# Altium schematic sheet ETH_PHY_SW_L2L3.SchDoc: RFSoC AMC
size 420 x 297 mm; CompanyName: WUT; DrawnBy: T. Przywozki; Organization: WUT ISE; Address1: Warsaw University of Technology; Address2: Nowowiejska 15/19 00-665 Warsaw; Address3: Tomasz.Przywozki@pw.edu.pl; DocumentNumber: 25; Revision: 1; SheetNumber: 25; SheetTotal: 45; Project: RFSoC AMC; ModifiedBy: T. Przywozki; CreateDate: -; CheckedDate: -; DivGrp: ISE; Designer: T. Przywozki; ModifiedDate: -; ProjectName: ADC/DAC MEZZANINE
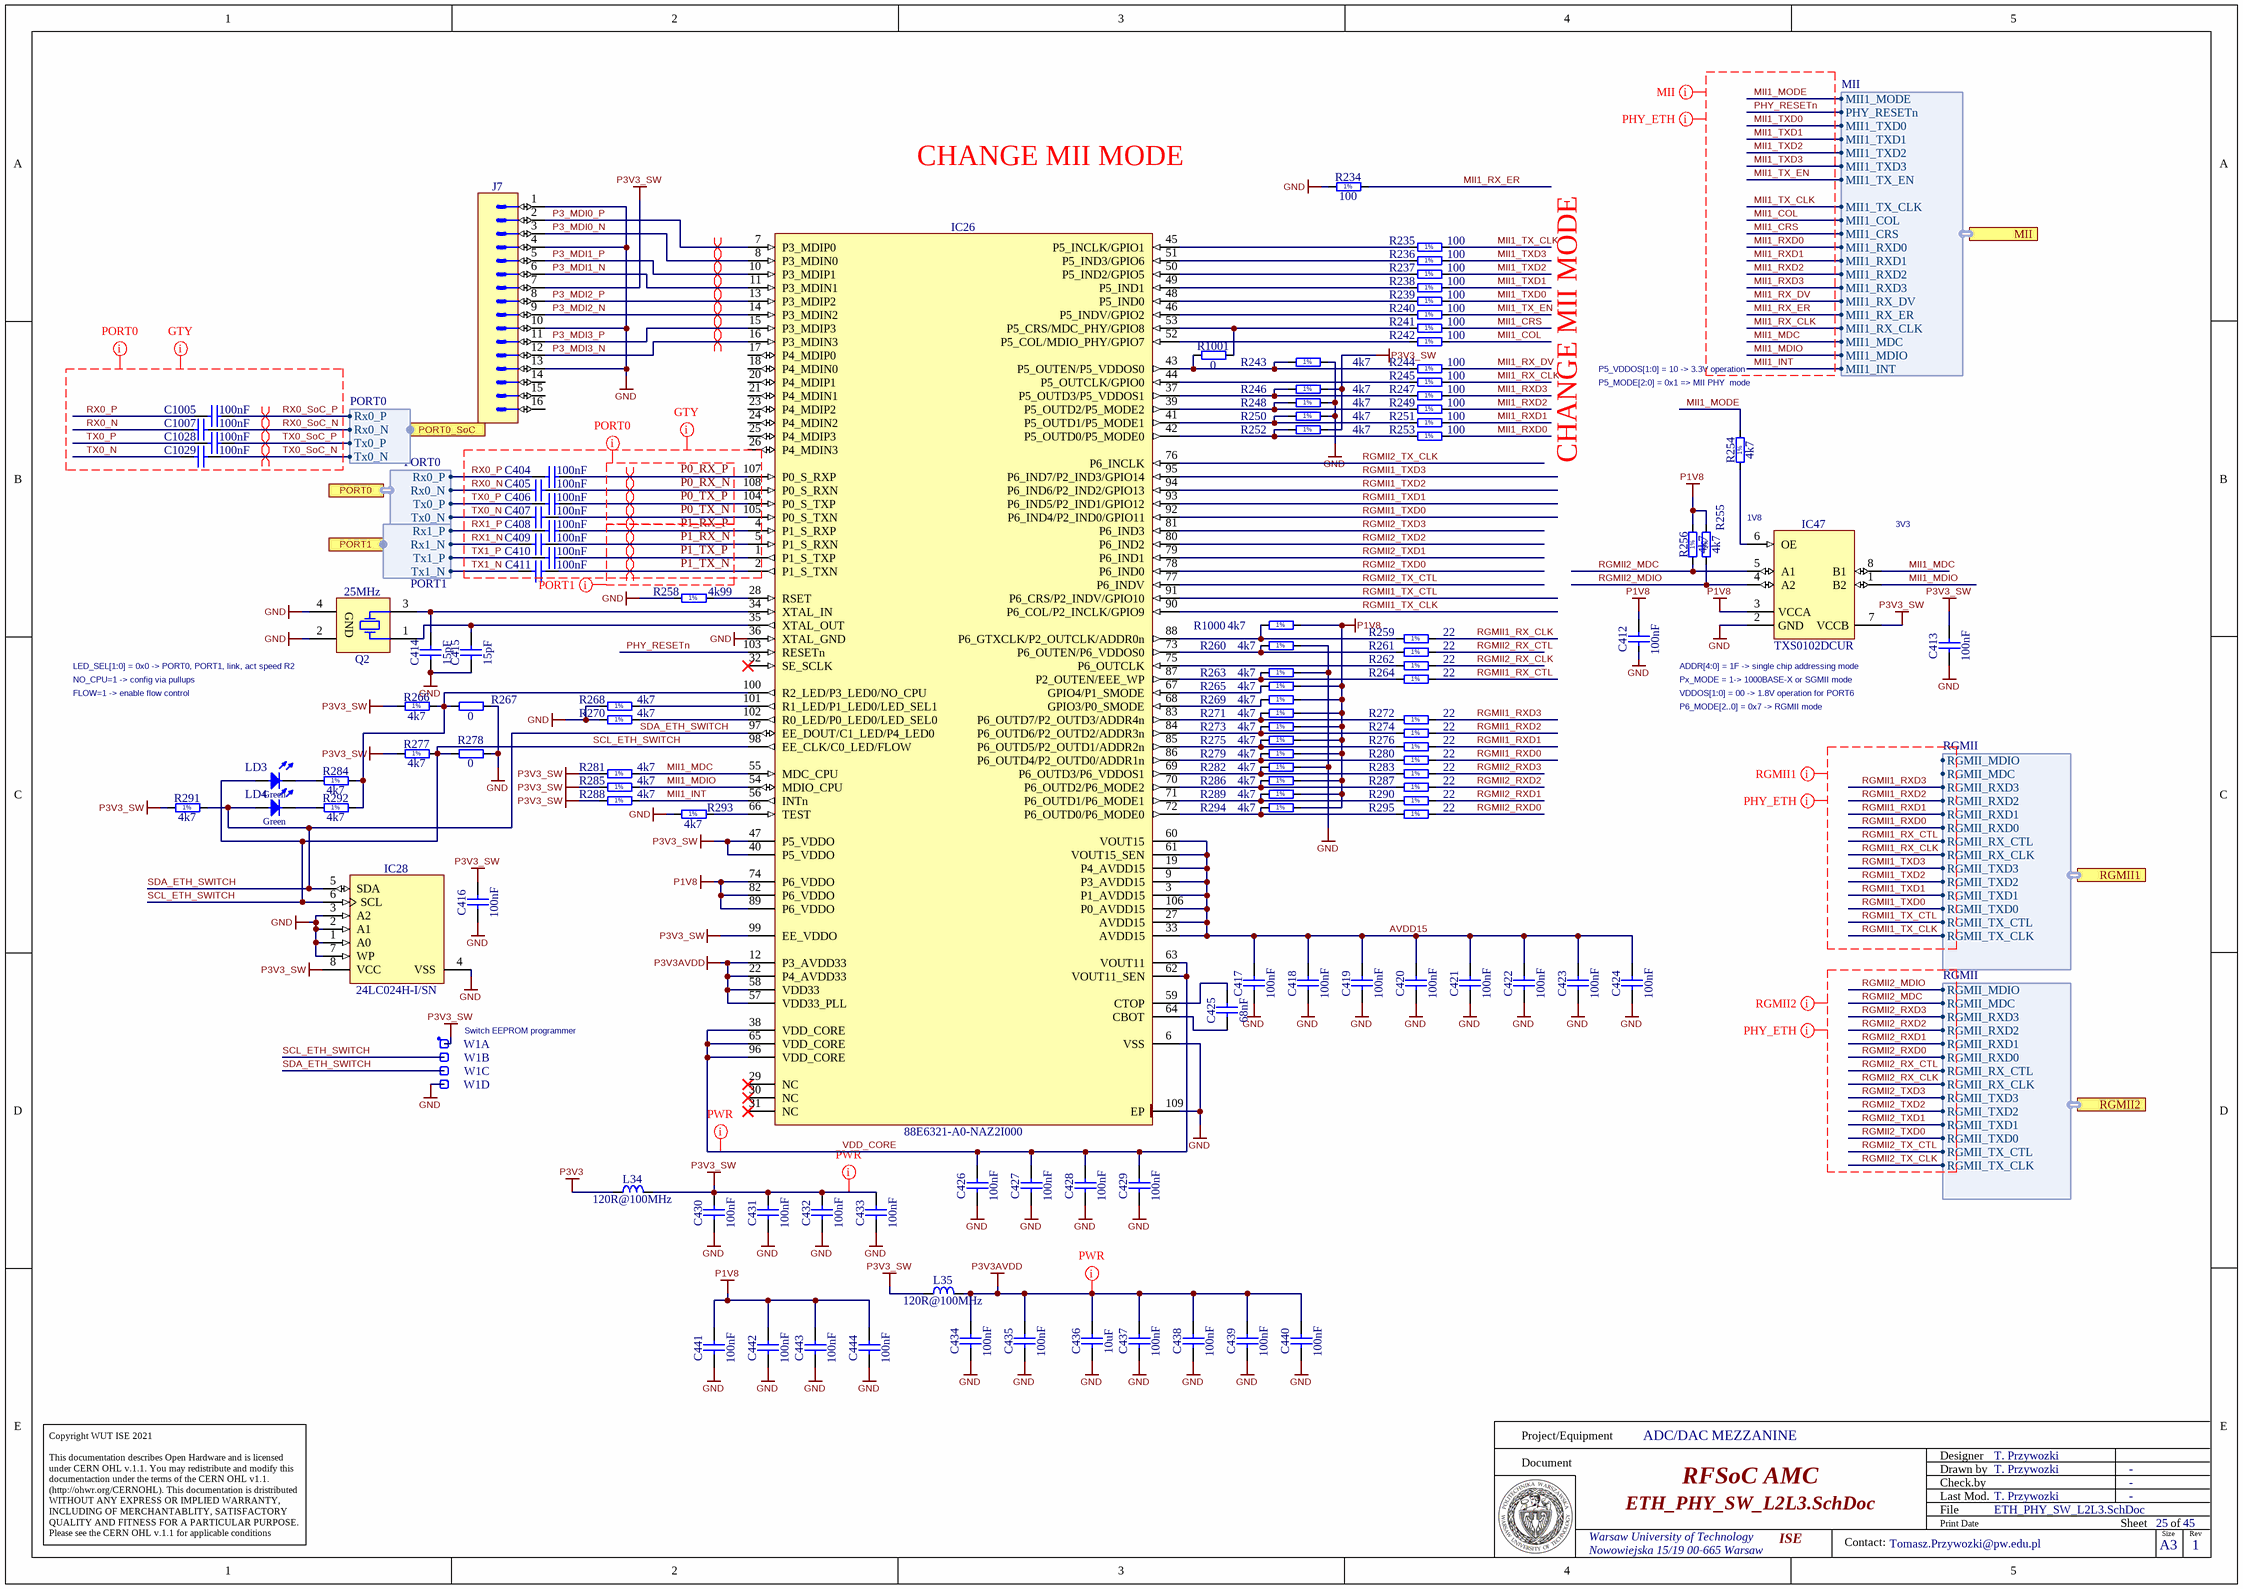
[diagram p0: ETH_PHY_SW_L2L3.SchDoc]

## Parts
C404  100nF  [CAPC0603X33N]
C405  100nF  [CAPC0603X33N]
C406  100nF  [CAPC0603X33N]
C407  100nF  [CAPC0603X33N]
C408  100nF  [CAPC0603X33N]
C409  100nF  [CAPC0603X33N]
C410  100nF  [CAPC0603X33N]
C411  100nF  [CAPC0603X33N]
C412  100nF  [CAPC0603X33N]
C413  100nF  [CAPC0603X33N]
C414  15pF  [CAPC1005X55N]
C415  15pF  [CAPC1005X55N]
C416  100nF  [CAPC0603X33N]
C417  100nF  [CAPC0603X33N]
C418  100nF  [CAPC0603X33N]
C419  100nF  [CAPC0603X33N]
C420  100nF  [CAPC0603X33N]
C421  100nF  [CAPC0603X33N]
C422  100nF  [CAPC0603X33N]
C423  100nF  [CAPC0603X33N]
C424  100nF  [CAPC0603X33N]
C425  68nF  [CAPC1005X55N]
C426  100nF  [CAPC0603X33N]
C427  100nF  [CAPC0603X33N]
C428  100nF  [CAPC0603X33N]
C429  100nF  [CAPC0603X33N]
C430  100nF  [CAPC0603X33N]
C431  100nF  [CAPC0603X33N]
C432  100nF  [CAPC0603X33N]
C433  100nF  [CAPC0603X33N]
C434  100nF  [CAPC0603X33N]
C435  100nF  [CAPC0603X33N]
C436  10uF  [CAPC1608X87N]
C437  100nF  [CAPC0603X33N]
C438  100nF  [CAPC0603X33N]
C439  100nF  [CAPC0603X33N]
C440  100nF  [CAPC0603X33N]
C441  100nF  [CAPC0603X33N]
C442  100nF  [CAPC0603X33N]
C443  100nF  [CAPC0603X33N]
C444  100nF  [CAPC0603X33N]
C1005  100nF  [CAPC0603X33N]
C1007  100nF  [CAPC0603X33N]
C1028  100nF  [CAPC0603X33N]
C1029  100nF  [CAPC0603X33N]
IC26  88E6321-A0-NAZ2I000  [QFN40P1200X1200X90-109N-S475]
IC28  24LC024H-I/SN  [SOIC127P600X175-8N]
IC47  TXS0102DCUR  [SOP50P310X90-8N]
J7  Milli-Grid™  [MOLEX_87759-1650]  (value not drawn)
L34  120R@100MHz  [INDC1608X65N]
L35  120R@100MHz  [INDC1608X65N]
LD3  Green  [LED_KINGBRIGHT_KPH-1608CGCK]
LD4  Green  [LED_KINGBRIGHT_KPH-1608CGCK]
Q2  25MHz  [XTAL_TXC_8Y]
R234  100  [RESC0603X28N]
R235  100  [RESC0603X28N]
R236  100  [RESC0603X28N]
R237  100  [RESC0603X28N]
R238  100  [RESC0603X28N]
R239  100  [RESC0603X28N]
R240  100  [RESC0603X28N]
R241  100  [RESC0603X28N]
R242  100  [RESC0603X28N]
R243  4k7  [RESC1005X40N]
R244  100  [RESC0603X28N]
R245  100  [RESC0603X28N]
R246  4k7  [RESC1005X40N]
R247  100  [RESC0603X28N]
R248  4k7  [RESC1005X40N]
R249  100  [RESC0603X28N]
R250  4k7  [RESC1005X40N]
R251  100  [RESC0603X28N]
R252  4k7  [RESC1005X40N]
R253  100  [RESC0603X28N]
R254  4k7  [RESC1005X40N]
R255  4k7  [RESC1005X40N]
R256  4k7  [RESC1005X40N]
R258  4k99  [RESC1608X55N]
R259  22  [RESC1005X40N]
R260  4k7  [RESC1005X40N]
R261  22  [RESC1005X40N]
R262  22  [RESC1005X40N]
R263  4k7  [RESC1005X40N]
R264  22  [RESC1005X40N]
R265  4k7  [RESC1005X40N]
R266  4k7  [RESC1005X40N]
R267  0  [RESC1005X40N]
R268  4k7  [RESC1005X40N]
R269  4k7  [RESC1005X40N]
R270  4k7  [RESC1005X40N]
R271  4k7  [RESC1005X40N]
R272  22  [RESC1005X40N]
R273  4k7  [RESC1005X40N]
R274  22  [RESC1005X40N]
R275  4k7  [RESC1005X40N]
R276  22  [RESC1005X40N]
R277  4k7  [RESC1005X40N]
R278  0  [RESC1005X40N]
R279  4k7  [RESC1005X40N]
R280  22  [RESC1005X40N]
R281  4k7  [RESC1005X40N]
R282  4k7  [RESC1005X40N]
R283  22  [RESC1005X40N]
R284  4k7  [RESC1005X40N]
R285  4k7  [RESC1005X40N]
R286  4k7  [RESC1005X40N]
R287  22  [RESC1005X40N]
R288  4k7  [RESC1005X40N]
R289  4k7  [RESC1005X40N]
R290  22  [RESC1005X40N]
R291  4k7  [RESC1005X40N]
R292  4k7  [RESC1005X40N]
R293  4k7  [RESC1005X40N]
R294  4k7  [RESC1005X40N]
R295  22  [RESC1005X40N]
R1000  4k7  [RESC1005X40N]
R1001  0  [RESC1005X40N]
W1  Header 4  [SAMTEC_MTLW-104-07-L-S-250]  (value not drawn)  (parts A,B,C,D of 4)

## Ports
MII (harness MII), PORT0 (harness PORT0), PORT0_SoC (harness PORT0), PORT1 (harness PORT1), RGMII1 (harness RGMII), RGMII2 (harness RGMII)

## Harnesses
RGMII: RGMII_TX_CLK, RGMII_TX_CTL, RGMII_TXD0, RGMII_TXD1, RGMII_TXD2, RGMII_TXD3, RGMII_RX_CTL, RGMII_RX_CLK, RGMII_RXD0, RGMII_RXD1, RGMII_RXD2, RGMII_RXD3, RGMII_MDC, RGMII_MDIO
MII: MII1_MODE, MII1_TXD0, MII1_TXD2, MII1_TXD3, MII1_TX_EN, MII1_TX_CLK, MII1_COL, MII1_CRS, MII1_RXD0, MII1_RXD1, MII1_RXD2, MII1_RXD3, MII1_RX_DV, MII1_RX_ER, MII1_RX_CLK, MII1_MDC, MII1_MDIO, MII1_INT, PHY_RESETn, MII1_TXD1
PORT1: Rx1_P, Rx1_N, Tx1_N, Tx1_P
PORT0: Rx0_P, Rx0_N, Tx0_N, Tx0_P

## Nets
GND: C412.1 C413.1 C414.1 C415.1 C416.1 C417.1 C418.1 C419.1 C420.1 C421.1 C422.1 C423.1 C424.1 C426.1 C427.1 C428.1 C429.1 C430.1 C431.1 C432.1 C433.1 C434.1 C435.1 C436.1 C437.1 C438.1 C439.1 C440.1 C441.1 C442.1 C443.1 C444.1 IC26.6(VSS) IC26.36(XTAL_GND) IC26.109(EP) IC28.1(A0) IC28.2(A1) IC28.3(A2) IC28.4(VSS) IC28.7(WP) IC47.2(GND) J7.1 J7.4 J7.10 J7.13 Q2.2(GND) Q2.4(GND) R234.1 R243.2 R248.2 R250.2 R258.1 R260.2 R263.2 R267.2 R268.1 R270.1 R278.2 R282.2 R293.1 W1.4
P1V8: C412.2 C441.2 C442.2 C443.2 C444.2 IC26.74(P6_VDDO) IC26.82(P6_VDDO) IC26.89(P6_VDDO) IC47.3(Vcca) R255.2 R256.2 R265.2 R269.2 R271.2 R273.2 R275.2 R279.2 R286.2 R289.2 R294.2 R1000.2
P3V3: L34.1
P3V3_SW: C413.2 C416.2 C430.2 C431.2 C432.2 C433.2 IC26.40(P5_VDDO) IC26.47(P5_VDDO) IC26.99(EE_VDDO) IC28.8(VCC) IC47.7(Vccb) J7.7 L34.2 L35.1 R246.2 R252.2 R266.1 R277.1 R281.1 R285.1 R288.1 R291.1 W1.1
P3V3AVDD: C434.2 C435.2 C436.2 C437.2 C438.2 C439.2 C440.2 IC26.12(P3_AVDD33) IC26.22(P4_AVDD33) IC26.57(VDD33_PLL) IC26.58(VDD33) L35.2
AVDD15: C417.2 C418.2 C419.2 C420.2 C421.2 C422.2 C423.2 C424.2 IC26.3(P1_AVDD15) IC26.9(P3_AVDD15) IC26.19(P4_AVDD15) IC26.27(AVDD15) IC26.33(AVDD15) IC26.60(VOUT15) IC26.61(VOUT15_SEN) IC26.106(P0_AVDD15)
MII1_COL: R242.2 ; port MII.MII1_COL
MII1_CRS: R241.2 ; port MII.MII1_CRS
MII1_INT: IC26.56(INTn) R288.2 ; port MII.MII1_INT
MII1_MDC: IC26.55(MDC_CPU) IC47.8(B1) R281.2 ; port MII.MII1_MDC
MII1_MDIO: IC26.54(MDIO_CPU) IC47.1(B2) R285.2 ; port MII.MII1_MDIO
MII1_MODE: R254.2 ; port MII.MII1_MODE
MII1_RX_CLK: R245.2 ; port MII.MII1_RX_CLK
MII1_RX_DV: R244.2 ; port MII.MII1_RX_DV
MII1_RX_ER: R234.2 ; port MII.MII1_RX_ER
MII1_RXD0: R253.2 ; port MII.MII1_RXD0
MII1_RXD1: R251.2 ; port MII.MII1_RXD1
MII1_RXD2: R249.2 ; port MII.MII1_RXD2
MII1_RXD3: R247.2 ; port MII.MII1_RXD3
MII1_TX_CLK: R235.2 ; port MII.MII1_TX_CLK
MII1_TX_EN: R240.2 ; port MII.MII1_TX_EN
MII1_TXD0: R239.2 ; port MII.MII1_TXD0
MII1_TXD1: R238.2 ; port MII.MII1_TXD1
MII1_TXD2: R237.2 ; port MII.MII1_TXD2
MII1_TXD3: R236.2 ; port MII.MII1_TXD3
P0_RX_N: C405.2 IC26.108(P0_S_RXN)
P0_RX_P: C404.2 IC26.107(P0_S_RXP)
P0_TX_N: C407.2 IC26.105(P0_S_TXN)
P0_TX_P: C406.2 IC26.104(P0_S_TXP)
P1_RX_N: C409.2 IC26.5(P1_S_RXN)
P1_RX_P: C408.2 IC26.4(P1_S_RXP)
P1_TX_N: C411.2 IC26.2(P1_S_TXN)
P1_TX_P: C410.2 IC26.1(P1_S_TXP)
P3_MDI0_N: IC26.8(P3_MDIN0) J7.3
P3_MDI0_P: IC26.7(P3_MDIP0) J7.2
P3_MDI1_N: IC26.11(P3_MDIN1) J7.6
P3_MDI1_P: IC26.10(P3_MDIP1) J7.5
P3_MDI2_N: IC26.14(P3_MDIN2) J7.9
P3_MDI2_P: IC26.13(P3_MDIP2) J7.8
P3_MDI3_N: IC26.16(P3_MDIN3) J7.12
P3_MDI3_P: IC26.15(P3_MDIP3) J7.11
PHY_RESETn: IC26.103(RESETn) ; port MII.PHY_RESETn
RGMII1_RX_CLK: R259.2 ; port RGMII1.RGMII_RX_CLK
RGMII1_RX_CTL: R264.2 ; port RGMII1.RGMII_RX_CTL
RGMII1_RXD0: R280.2 ; port RGMII1.RGMII_RXD0
RGMII1_RXD1: R276.2 ; port RGMII1.RGMII_RXD1
RGMII1_RXD2: R274.2 ; port RGMII1.RGMII_RXD2
RGMII1_RXD3: R272.2 ; port RGMII1.RGMII_RXD3
RGMII1_TX_CLK: IC26.90(P6_COL/P2_INCLK/GPIO9) ; port RGMII1.RGMII_TX_CLK
RGMII1_TX_CTL: IC26.91(P6_CRS/P2_INDV/GPIO10) ; port RGMII1.RGMII_TX_CTL
RGMII1_TXD0: IC26.92(P6_IND4/P2_IND0/GPIO11) ; port RGMII1.RGMII_TXD0
RGMII1_TXD1: IC26.93(P6_IND5/P2_IND1/GPIO12) ; port RGMII1.RGMII_TXD1
RGMII1_TXD2: IC26.94(P6_IND6/P2_IND2/GPIO13) ; port RGMII1.RGMII_TXD2
RGMII1_TXD3: IC26.95(P6_IND7/P2_IND3/GPIO14) ; port RGMII1.RGMII_TXD3
RGMII2_MDC: IC47.5(A1) R256.1 ; port RGMII2.RGMII_MDC
RGMII2_MDIO: IC47.4(A2) R255.1 ; port RGMII2.RGMII_MDIO
RGMII2_RX_CLK: R262.2 ; port RGMII2.RGMII_RX_CLK
RGMII2_RX_CTL: R261.2 ; port RGMII2.RGMII_RX_CTL
RGMII2_RXD0: R295.2 ; port RGMII2.RGMII_RXD0
RGMII2_RXD1: R290.2 ; port RGMII2.RGMII_RXD1
RGMII2_RXD2: R287.2 ; port RGMII2.RGMII_RXD2
RGMII2_RXD3: R283.2 ; port RGMII2.RGMII_RXD3
RGMII2_TX_CLK: IC26.76(P6_INCLK) ; port RGMII2.RGMII_TX_CLK
RGMII2_TX_CTL: IC26.77(P6_INDV) ; port RGMII2.RGMII_TX_CTL
RGMII2_TXD0: IC26.78(P6_IND0) ; port RGMII2.RGMII_TXD0
RGMII2_TXD1: IC26.79(P6_IND1) ; port RGMII2.RGMII_TXD1
RGMII2_TXD2: IC26.80(P6_IND2) ; port RGMII2.RGMII_TXD2
RGMII2_TXD3: IC26.81(P6_IND3) ; port RGMII2.RGMII_TXD3
RX0_N: C405.1 C1007.1 ; port PORT0.Rx0_N
RX0_P: C404.1 C1005.1 ; port PORT0.Rx0_P
RX0_SoC_N: C1007.2 ; port PORT0_SoC.Rx0_N
RX0_SoC_P: C1005.2 ; port PORT0_SoC.Rx0_P
RX1_N: C409.1 ; port PORT1.Rx1_N
RX1_P: C408.1 ; port PORT1.Rx1_P
SCL_ETH_SWITCH: IC26.98(EE_CLK/C0_LED/FLOW) IC28.6(SCL) LD3.2(A) R277.2 R278.1 W1.2
SDA_ETH_SWITCH: IC26.97(EE_DOUT/C1_LED/P4_LED0) IC28.5(SDA) LD4.2(A) R291.2 W1.3
TX0_N: C407.1 C1029.1 ; port PORT0.Tx0_N
TX0_P: C406.1 C1028.1 ; port PORT0.Tx0_P
TX0_SoC_N: C1029.2 ; port PORT0_SoC.Tx0_N
TX0_SoC_P: C1028.2 ; port PORT0_SoC.Tx0_P
TX1_N: C411.1 ; port PORT1.Tx1_N
TX1_P: C410.1 ; port PORT1.Tx1_P
VDD_CORE: C426.2 C427.2 C428.2 C429.2 IC26.38(VDD_CORE) IC26.62(VOUT11_SEN) IC26.63(VOUT11) IC26.65(VDD_CORE) IC26.96(VDD_CORE)
NetC414_2: C414.2 IC26.34(XTAL_IN) Q2.3(X)
NetC415_2: C415.2 IC26.35(XTAL_OUT) Q2.1(X)
NetC425_1: C425.1 IC26.64(CBOT)
NetC425_2: C425.2 IC26.59(CTOP)
NetIC26_28: IC26.28(RSET) R258.2
NetIC26_37: IC26.37(P5_OUTD3/P5_VDDOS1) R246.1 R247.1
NetIC26_39: IC26.39(P5_OUTD2/P5_MODE2) R248.1 R249.1
NetIC26_41: IC26.41(P5_OUTD1/P5_MODE1) R250.1 R251.1
NetIC26_42: IC26.42(P5_OUTD0/P5_MODE0) R252.1 R253.1
NetIC26_43: IC26.43(P5_OUTEN/P5_VDDOS0) R243.1 R244.1 R1001.1
NetIC26_44: IC26.44(P5_OUTCLK/GPIO0) R245.1
NetIC26_45: IC26.45(P5_INCLK/GPIO1) R235.1
NetIC26_46: IC26.46(P5_INDV/GPIO2) R240.1
NetIC26_48: IC26.48(P5_IND0) R239.1
NetIC26_49: IC26.49(P5_IND1) R238.1
NetIC26_50: IC26.50(P5_IND2/GPIO5) R237.1
NetIC26_51: IC26.51(P5_IND3/GPIO6) R236.1
NetIC26_52: IC26.52(P5_COL/MDIO_PHY/GPIO7) R242.1
NetIC26_53: IC26.53(P5_CRS/MDC_PHY/GPIO8) R241.1 R1001.2
NetIC26_66: IC26.66(TEST) R293.2
NetIC26_67: IC26.67(GPIO4/P1_SMODE) R265.1
NetIC26_68: IC26.68(GPIO3/P0_SMODE) R269.1
NetIC26_69: IC26.69(P6_OUTD3/P6_VDDOS1) R282.1 R283.1
NetIC26_70: IC26.70(P6_OUTD2/P6_MODE2) R286.1 R287.1
NetIC26_71: IC26.71(P6_OUTD1/P6_MODE1) R289.1 R290.1
NetIC26_72: IC26.72(P6_OUTD0/P6_MODE0) R294.1 R295.1
NetIC26_73: IC26.73(P6_OUTEN/P6_VDDOS0) R260.1 R261.1
NetIC26_75: IC26.75(P6_OUTCLK) R262.1
NetIC26_83: IC26.83(P6_OUTD7/P2_OUTD3/ADDR4n) R271.1 R272.1
NetIC26_84: IC26.84(P6_OUTD6/P2_OUTD2/ADDR3n) R273.1 R274.1
NetIC26_85: IC26.85(P6_OUTD5/P2_OUTD1/ADDR2n) R275.1 R276.1
NetIC26_86: IC26.86(P6_OUTD4/P2_OUTD0/ADDR1n) R279.1 R280.1
NetIC26_87: IC26.87(P2_OUTEN/EEE_WP) R263.1 R264.1
NetIC26_88: IC26.88(P6_GTXCLK/P2_OUTCLK/ADDR0n) R259.1 R1000.1
NetIC26_100: IC26.100(R2_LED/P3_LED0/NO_CPU) R266.2 R267.1 R284.2 R292.2
NetIC26_101: IC26.101(R1_LED/P1_LED0/LED_SEL1) R268.2
NetIC26_102: IC26.102(R0_LED/P0_LED0/LED_SEL0) R270.2
NetIC47_6: IC47.6(OE) R254.1
NetLD3_1: LD3.1(C) R284.1
NetLD4_1: LD4.1(C) R292.1

Not connected (* = marked no-connect by the designer): IC26 17(P4_MDIP0) 18(P4_MDIN0) 20(P4_MDIP1) 21(P4_MDIN1) 23(P4_MDIP2) 24(P4_MDIN2) 25(P4_MDIP3) 26(P4_MDIN3) 29(NC)* 30(NC)* 31(NC)* 32(SE_SCLK)*; J7 14 15 16

## Layout directives
net class MII: MII1_COL, MII1_CRS, MII1_INT, MII1_MDC, MII1_MDIO, MII1_MODE, MII1_RX_CLK, MII1_RX_DV, MII1_RX_ER, MII1_RXD0, MII1_RXD1, MII1_RXD2, MII1_RXD3, MII1_TX_CLK, MII1_TX_EN, MII1_TXD0, MII1_TXD1, MII1_TXD2, MII1_TXD3, PHY_RESETn
net class PHY_ETH: MII1_COL, MII1_CRS, MII1_INT, MII1_MDC, MII1_MDIO, MII1_MODE, MII1_RX_CLK, MII1_RX_DV, MII1_RX_ER, MII1_RXD0, MII1_RXD1, MII1_RXD2, MII1_RXD3, MII1_TX_CLK, MII1_TX_EN, MII1_TXD0, MII1_TXD1, MII1_TXD2, MII1_TXD3, PHY_RESETn, RGMII1_RX_CLK, RGMII1_RX_CTL, RGMII1_RXD0, RGMII1_RXD1, RGMII1_RXD2, RGMII1_RXD3, RGMII1_TX_CLK, RGMII1_TX_CTL, RGMII1_TXD0, RGMII1_TXD1, RGMII1_TXD2, RGMII1_TXD3, RGMII2_MDC, RGMII2_MDIO, RGMII2_RX_CLK, RGMII2_RX_CTL, RGMII2_RXD0, RGMII2_RXD1, RGMII2_RXD2, RGMII2_RXD3, RGMII2_TX_CLK, RGMII2_TX_CTL, RGMII2_TXD0, RGMII2_TXD1, RGMII2_TXD2, RGMII2_TXD3
net class RGMII1: RGMII1_RX_CLK, RGMII1_RX_CTL, RGMII1_RXD0, RGMII1_RXD1, RGMII1_RXD2, RGMII1_RXD3, RGMII1_TX_CLK, RGMII1_TX_CTL, RGMII1_TXD0, RGMII1_TXD1, RGMII1_TXD2, RGMII1_TXD3
net class RGMII2: RGMII2_MDC, RGMII2_MDIO, RGMII2_RX_CLK, RGMII2_RX_CTL, RGMII2_RXD0, RGMII2_RXD1, RGMII2_RXD2, RGMII2_RXD3, RGMII2_TX_CLK, RGMII2_TX_CTL, RGMII2_TXD0, RGMII2_TXD1, RGMII2_TXD2, RGMII2_TXD3
net class PORT0: P0_RX_N, P0_RX_P, P0_TX_N, P0_TX_P, RX0_N, RX0_P, RX0_SoC_N, RX0_SoC_P, TX0_N, TX0_P, TX0_SoC_N, TX0_SoC_P
differential pair: P0_RX_N, P0_RX_P, P0_TX_N, P0_TX_P, P1_RX_N, P1_RX_P, P1_TX_N, P1_TX_P, P3_MDI0_N, P3_MDI0_P, P3_MDI1_N, P3_MDI1_P, P3_MDI2_N, P3_MDI2_P, P3_MDI3_N, P3_MDI3_P, RX0_SoC_N, RX0_SoC_P, TX0_SoC_N, TX0_SoC_P
net class GTY; net class GT: P0_RX_N, P0_RX_P, P0_TX_N, P0_TX_P, P1_RX_N, P1_RX_P, P1_TX_N, P1_TX_P, RX0_N, RX0_P, RX0_SoC_N, RX0_SoC_P, RX1_N, RX1_P, TX0_N, TX0_P, TX0_SoC_N, TX0_SoC_P, TX1_N, TX1_P
net class PORT1: P1_RX_N, P1_RX_P, P1_TX_N, P1_TX_P
net class PWR: P3V3_SW, P3V3AVDD, VDD_CORE

## Notes on the sheet
- CHANGE MII MODE
- P5_VDDOS[1:0] = 10 -> 3.3V operation
- (near R254) P5_MODE[2:0] = 0x1 => MII PHY  mode
- (near IC47) 1V8
- (near IC47) 3V3
- (near Q2) LED_SEL[1:0] = 0x0 -> PORT0, PORT1, link, act speed R2
- ADDR[4:0] = 1F -> single chip addressing mode
- NO_CPU=1 -> config via pullups
- FLOW=1 -> enable flow control
- VDDOS[1:0] = 00 -> 1.8V operation for PORT6
- P6_MODE[2..0] = 0x7 -> RGMII mode
- Px_MODE = 1-> 1000BASE-X or SGMII mode
- (near W1) Switch EEPROM programmer
- Project/Equipment
- Document
- Designer
- Drawn by
- Check.by
- Copyright WUT ISE 2021
  This documentation describes Open Hardware and is licensed under CERN OHL v.1.1. You may redistribute and modify this documentaction under the terms of the CERN OHL v1.1.
  (http://ohwr.org/CERNOHL). This documentation is dristributed WITHOUT ANY EXPRESS OR IMPLIED WARRANTY, INCLUDING OF MERCHANTABLITY, SATISFACTORY QUALITY AND FITNESS FOR A PARTICULAR PURPOSE. Please see the CERN OHL v.1.1 for applicable conditions
- File
- Last Mod.
- Print Date
- Sheet
- Size
- A3
- of
- Rev
- Contact:
- (in symbol R0201_100R_1%_0.05W_200PPM) 1%
- (in symbol R0402_4K7_1%_0.0625W_100PPM) 1%
- (in symbol R0402_22R_1%_0.0625W_100PPM) 1%
- (in symbol R0603_4K99_1%_0.063W_50PPM) 1%
- (in symbol TXS0102DCUR) VCCA; VCCB

## Library data of the parts
C404-C413 C416-C424 C426-C435 C437-C444 C1005 C1007 C1028 C1029 = CC0201_100NF_6.3V_10%_X5R: Non-polarised capacitor; Manufacturer: GENERIC; Part Description: SMD Multilayer Chip Ceramic Capacitor; Manufacturer1 Part Number: 02016D104KAT2A; Tolerance: ±10%; Voltage: 6.3V; TC: X5R; Manufacturer Part Number: CC0201_100NF_6.3V_10%_X5R; Part Number: CC0201_100NF_6.3V_10%_X5R; Value: 100nF; Component Kind: Standard; Component Type: Standard; Pin Count: 2; Status: Not Recommended; Case: 0201; Mounted: Yes; Socket: No; SMD: Yes; Sense: No; Manufacturer1 Example: AVX; Manufacturer1 ComponentHeight: 0.33mm; HelpURL: \\cern.ch\dfs\Applications\Altium\Datasheets\CC0201_X5R_AVX.pdf; Author: CERN DEM JLC; CreateDate: 03/12/2007; LatestRevisionDate: 03/12/2007
C414 C415 = CC0402_15PF_50V_5%_C0G: Non-polarised capacitor; Manufacturer: GENERIC; Part Description: SMD Multilayer Chip Ceramic Capacitor; Manufacturer1 Part Number: C0402C150J5GACTU; Tolerance: ±5%; Voltage: 50V; TC: C0G/NP0; Manufacturer Part Number: CC0402_15PF_50V_5%_C0G; Part Number: CC0402_15PF_50V_5%_C0G; Value: 15pF; Component Kind: Standard; Component Type: Standard; Pin Count: 2; Status: Preferred; Case: 0402; Mounted: Yes; Socket: No; SMD: Yes; Sense: No; Manufacturer1 Example: KEMET; Manufacturer1 ComponentHeight: 0.55mm; HelpURL: \\cern.ch\dfs\Applications\Altium\Datasheets\CC0805_C0G_KEMET_(Commercial Grade).pdf; Author: CERN DEM JLC; CreateDate: 03.12.2007; LatestRevisionDate: 22.04.2015
C425 = CC0402_68NF_16V_10%_X7R: Non-polarised capacitor; Manufacturer: GENERIC; Part Description: SMD Multilayer Chip Ceramic Capacitor; Manufacturer1 Part Number: 223878715647; Tolerance: ±10%; Voltage: 16V; TC: X7R; Manufacturer Part Number: CC0402_68NF_16V_10%_X7R; Part Number: CC0402_68NF_16V_10%_X7R; Value: 68nF; Component Kind: Standard; Component Type: Standard; Pin Count: 2; Status: Not Recommended; Case: 0402; Mounted: Yes; Socket: No; SMD: Yes; Sense: No; Manufacturer1 Example: PHYCOMP; Manufacturer1 ComponentHeight: 0.55mm; HelpURL: \\cern.ch\dfs\Applications\Altium\Datasheets\CC0402_X7R_PHYCOMP.pdf; Author: CERN DEM JLC; CreateDate: 03.12.2007; LatestRevisionDate: 03.12.2007
C436 = CC0603_10uF_6.3V_20%_X5R: Non-polarised capacitor; Manufacturer: GENERIC; Part Description: SMD Multilayer Chip Ceramic Capacitor; Manufacturer1 Part Number: C0603C106M9PAC; Tolerance: ±20%; Voltage: 6.3V; TC: X5R; Manufacturer Part Number: CC0603_10uF_6.3V_20%_X5R; Part Number: CC0603_10UF_6.3V_20%_X5R; Value: 10uF; Component Kind: Standard; Component Type: Standard; Pin Count: 2; Status: Preferred; Case: 0603; Mounted: Yes; Socket: No; SMD: Yes; Sense: No; Manufacturer1 Example: KEMET; Manufacturer1 ComponentHeight: 0.95mm; HelpURL: \\cern.ch\dfs\Applications\Altium\Datasheets\CC0603_X5R_KEMET.pdf; Author: CERN DEM JLC; CreateDate: 03.12.2007; LatestRevisionDate: 03.12.2007
IC26 = 88E6321-A0-NAZ2I000: 7 Port Gigabit AVB Switch With 2 PHYs And Energy Efficient Ethernet (EEE); Manufacturer: MARVELL; PressFit: No; Bonding: No; Manufacturer Part Number: 88E6321-A0-NAZ2I000; PackageDescription: QFN, 0.40mm pitch, square; 27 pin X 27 pin, 12.00mm X 12.00mm, IPC Medium Density; Part Description: 7 Port Gigabit AVB Switch With 2 PHYs And Energy Efficient Ethernet (EEE); Part Number: 88E6321-A0-NAZ2I000; Component Kind: Standard; Component Type: Standard; Device: 88E6321-A0-NAZ2I000; Status: Not Recommended; Pin Count: 109; Case: QFN108; Mounted: Yes; Socket: No; SMD: Yes; Sense: No; ComponentHeight: 0.9mm; HelpURL: \\cern.ch\dfs\Applications\Altium\Datasheets\88E6321-A0-NAZ2I000.pdf; Author: CERN DEM MR; CreateDate: 23/05/2016; LatestRevisionDate: 30/03/2017
IC28 = 24LC024H-I/SN: 2K I2C Serial EEPROM With Half-Array Write Protect; Manufacturer: MICROCHIP TECHNOLOGY; Part Description: 2.5V-5.5V, 2K (256 x 8-bit) I2C Serial EEPROM With Half-Array Write Protect; PressFit: No; Bonding: No; Manufacturer Part Number: 24LC024H-I/SN; PackageDescription: SOIC 8, Pitch 1.27mm - Body 4x5mm, IPC Medium Density; Part Number: 24LC024H-I/SN; Component Kind: Standard; Component Type: Standard; Device: 24LC024H-I/SN; Pin Count: 8; Case: SOIC8; Mounted: Yes; Socket: No; SMD: Yes; Sense: No; ComponentHeight: 1.75mm; HelpURL: \\cern.ch\dfs\Applications\Altium\Datasheets\24LC024H-I-SN.pdf; Author: CERN DEM JLC; CreateDate: 24.01.2011; LatestRevisionDate: 24.01.2011
IC47 = TXS0102DCUR: 2-Bit Bidirectionnal Voltage-Level Translator for Open-Drain And Push-Pull Applications; Manufacturer: TEXAS INSTRUMENTS; PressFit: No; Bonding: No; Manufacturer Part Number: TXS0102DCUR; PackageDescription: SOP, 0.50mm Pitch; 8 pin, 2.30mm W X 2.00mm L X 0.90mm H body, PC Medium Density; Part Description: 2-Bit Bidirectionnal Voltage-Level Translator for Open-Drain And Push-Pull Applications; Part Number: TXS0102DCUR; Component Kind: Standard; Component Type: Standard; Device: TXS0102DCUR; Pin Count: 8; Case: TSSOP8; Mounted: Yes; Socket: No; SMD: Yes; Sense: No; ComponentHeight: 0.9mm; Author: CERN DEM JLC; HelpURL: \\cern.ch\dfs\Applications\Altium\Datasheets\TXS0102DCUR.pdf; CreateDate: 08/07/2014; LatestRevisionDate: 08/07/2014
J7 = MOLEX_87759-1650: Connector 16 Male; Part Description: 2.00mm (.079") Pitch Milli-Grid™ Header, Vertical with Press-fit Plastic Pegs, 16 Circuits; Manufacturer: MOLEX; PressFit: No; Part Number: MOLEX_87759-1650; Component Kind: Standard; Component Type: Standard; Pin Count: 16; Family: Milli-Grid™; Mounted: Yes; Socket: No; SMD: Yes; Sense: No; Status: None; Manufacturer Part Number: 87759-1650; ComponentHeight: 5.3mm; HelpURL: \\cern.ch\dfs\Applications\Altium\Datasheets\MOLEX_87759-1650.pdf; Author: CERN DEM MR; CreateDate: 31.05.2016; LatestRevisionDate: 31.05.2016
L34 L35 = IND0603_MURATA_BLM18SG121TN1D: Inductor; Manufacturer: MURATA; Part Description: SMD EMIFIL Suppression Chip Ferrite Bead; Tolerance: ±25%; Power: 3A; Resistance: 0.025R; Manufacturer Part Number: BLM18SG121TN1D; Part Number: IND0603_MURATA_BLM18SG121TN1D; Value: 120R@100MHz; Component Kind: Standard; Component Type: Standard; Pin Count: 2; Status: None; Case: 0603; Mounted: Yes; Socket: No; SMD: Yes; Sense: No; ComponentHeight: 0.65mm; HelpURL: \\cern.ch\dfs\Applications\Altium\Datasheets\IND0603_MURATA_BLM18S.pdf; Author: CERN DEM JLC; CreateDate: 23/07/2014; LatestRevisionDate: 23/07/2014
LD3 LD4 = LED_KINGBRIGHT_KPH-1608CGCK: LED Green 1C 2A; Part Description: SMD Green LED, Case 1.6mmX0.8mm(0603), 0.65mm Thickness; Bonding: No; PressFit: No; Author: CERN DEM JLC; Color: Green; Component Kind: Standard; Component Type: Standard; ComponentHeight: 0.65mm; CreateDate: 03.07.2017; HelpURL: \\cern.ch\dfs\Applications\Altium\Datasheets\LED_KINGBRIGHT_KPH-1608CGCK.pdf; LatestRevisionDate: 03.07.2017; Manufacturer Part Number: KPH-1608CGCK; Manufacturer: KINGBRIGHT; Mounted: Yes; PackageDescription: SMT Green LED, Case 0603, Body L 1.6 x W 0.8mm H 0.65mm; Part Number: LED_KINGBRIGHT_KPH-1608CGCK; Pin Count: 2; Sense: No; SMD: Yes; Socket: No
Q2 = XTAL_25MHZ_TXC_8Y-25.000MAAJ-T: Crystal 4 pins 1=XTAL Control 2=GND3=XTAL 4=GND; Manufacturer: TXC CORPORATION; Part Description: ±30ppm 18pF -20°C to +70°C  4 Pins, 2x1.6X0.5mm, SMD Seam Sealing Crystal, 8Y Serie; PressFit: No; Bonding: No; Manufacturer Part Number: 8Y-25.000MAAJ-T; PackageDescription: 4 Pins, 2x1.6X0.5mm, SMD Seam Sealing Crystal, 8Y Serie; Part Number: XTAL_25MHZ_TXC_8Y-25.000MAAJ-T; Value: 25MHz; Component Kind: Standard; Component Type: Standard; Pin Count: 4; Mounted: Yes; Socket: No; SMD: Yes; Sense: No; ComponentHeight: 13.6mm; HelpURL: \\cern.ch\dfs\Applications\Altium\Datasheets\XTAL_TXC_8Y.pdf; Author: CERN DEM JLC; CreateDate: 08.03.2012; LatestRevisionDate: 08.03.2012
R234-R242 R244 R245 R247 R249 R251 R253 = R0201_100R_1%_0.05W_200PPM: Resistor - 1%; Manufacturer: GENERIC; Part Description: Thick Film Chip Resistor; Manufacturer1 Part Number: CRCW0201100RFNED; Power: 0.05W; TC: ±200ppm/°C; PressFit: No; Manufacturer Part Number: R0201_100R_1%_0.05W_200PPM; Part Number: R0201_100R_1%_0.05W_200PPM; Tolerance: ±1%; Value: 100; Component Kind: Standard; Component Type: Standard; Pin Count: 2; Status: Not Recommended; Case: 0201; Mounted: Yes; Sense: No; Socket: No; SMD: Yes; Manufacturer1 Example: VISHAY; Manufacturer1 ComponentHeight: 0.27mm; HelpURL: \\cern.ch\dfs\Applications\Altium\Datasheets\R0201_VISHAY_CRCW0201 e3.pdf; Author: CERN DEM JLC; CreateDate: 13.11.2014; LatestRevisionDate: 13.11.2014
R243 R246 R248 R250 R252 R254-R256 R260 R263 R265 R266 R268-R271 R273 R275 R277 R279 R281 R282 R284-R286 R288 R289 R291-R294 R1000 = R0402_4K7_1%_0.0625W_100PPM: Resistor - 1%; Manufacturer: GENERIC; Part Description: General Purpose Thick Film Chip Resistor; Manufacturer1 Part Number: 232270674702L; TC: ±100ppm/°C; PressFit: No; Manufacturer Part Number: R0402_4K7_1%_0.0625W_100PPM; Part Number: R0402_4K7_1%_0.0625W_100PPM; Tolerance: ±1%; Value: 4k7; Component Kind: Standard; Component Type: Standard; Pin Count: 2; Status: Not Recommended; Power: 0.0625W; Case: 0402; Mounted: Yes; Sense: No; Socket: No; SMD: Yes; Manufacturer1 Example: YAGEO PHYCOMP; Manufacturer1 ComponentHeight: 0.4mm; HelpURL: \\cern.ch\dfs\Applications\Altium\Datasheets\R0402_Phycomp_RC0402.pdf; Author: CERN DEM JLC; CreateDate: 03/12/2007; LatestRevisionDate: 17/10/2012
R258 = R0603_4K99_1%_0.063W_50PPM: Resistor - 1%; Manufacturer: GENERIC; Part Description: General Purpose Thick Film Chip Resistor; Manufacturer1 Part Number: CPF0603F4K99C1; Power: 0.1W; TC: ±50ppm/°C; PressFit: No; Manufacturer Part Number: R0603_4K99_1%_0.063W_50PPM; Part Number: R0603_4K99_1%_0.063W_50PPM; Tolerance: ±1%; Value: 4k99; Component Kind: Standard; Component Type: Standard; Pin Count: 2; Status: None; Case: 0603; Mounted: Yes; Sense: No; Socket: No; SMD: Yes; Manufacturer1 Example: TYCO NEOHM; Manufacturer1 ComponentHeight: 0.55mm; HelpURL: \\cern.ch\dfs\Applications\Altium\Datasheets\R0603_TYCO_CPF.pdf; Author: CERN DEM JLC; CreateDate: 20.05.2010; LatestRevisionDate: 20.05.2010
R259 R261 R262 R264 R272 R274 R276 R280 R283 R287 R290 R295 = R0402_22R_1%_0.0625W_100PPM: Resistor - 1%; Manufacturer: GENERIC; Part Description: General Purpose Thick Film Chip Resistor; Manufacturer1 Part Number: 232270672209L; TC: ±100ppm/°C; PressFit: No; Manufacturer Part Number: R0402_22R_1%_0.0625W_100PPM; Part Number: R0402_22R_1%_0.0625W_100PPM; Tolerance: ±1%; Value: 22; Component Kind: Standard; Component Type: Standard; Pin Count: 2; Status: Not Recommended; Power: 0.0625W; Case: 0402; Mounted: Yes; Sense: No; Socket: No; SMD: Yes; Manufacturer1 Example: YAGEO PHYCOMP; Manufacturer1 ComponentHeight: 0.4mm; HelpURL: \\cern.ch\dfs\Applications\Altium\Datasheets\R0402_Phycomp_RC0402.pdf; Author: CERN DEM JLC; CreateDate: 03/12/2007; LatestRevisionDate: 17/10/2012
R267 R278 R1001 = R0402_0R_JUMPER: Resistor; Part Description: 1A (0.05R Max DC Resistance) Zero Ohm Jumper; Manufacturer: GENERIC; Manufacturer1 Part Number: 232270591001L; PressFit: No; Part Number: R0402_0R_JUMPER; Component Kind: Standard; Component Type: Standard; Pin Count: 2; Value: 0; Status: Not Recommended; Manufacturer Part Number: R0402_0R_JUMPER; Case: 0402; Mounted: Yes; Sense: No; Socket: No; SMD: Yes; Manufacturer1 Example: YAGEO PHYCOMP; Manufacturer1 ComponentHeight: 0.4mm; HelpURL: \\cern.ch\dfs\Applications\Altium\Datasheets\R0402_Phycomp_RC0402.pdf; Author: CERN DEM JLC; CreateDate: 03.12.2007; LatestRevisionDate: 17.10.2012
W1 = SAMTEC_MTLW-104-07-L-S-250: 4 Mini Wire-Wrap Contact Strip Header; Manufacturer: SAMTEC; Part Description: 4 Contacts, Pitch 2.54mm, Single Row Through Mount Straight Header (Post Lead = 6.35mm, Tail Lead 3.05mm, Insulator 1.52mm); PressFit: No; Manufacturer Part Number: MTLW-104-07-L-S-250; Part Number: SAMTEC_MTLW-104-07-L-S-250; Component Kind: Standard; Component Type: Standard; Pin Count: 4; Family: Header 4; Mounted: Yes; Socket: No; Sense: No; SMD: No; Status: None; ComponentHeight: 7.87mm; HelpURL: \\cern.ch\dfs\Applications\Altium\Datasheets\SAMTEC_MTLW-104-07-L-S-250.pdf; Author: CERN DEM JLC; CreateDate: 13.12.2012; LatestRevisionDate: 13.12.2012